# Altium schematic sheet SD-Card.SchDoc
size A4
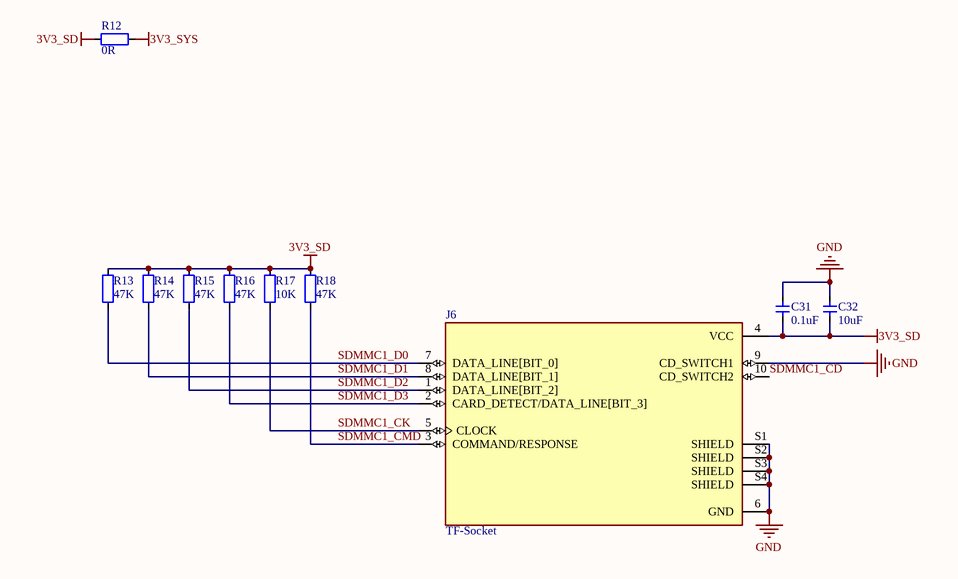
[diagram p0: SD-Card.SchDoc]

## Parts
C31  0.1uF  [CAP_0402]
C32  10uF  [CAP_0402]
J6  TF-Socket  [TF-Card-Amphenol with TF]
R12  0R  [RES_0402]
R13  47K  [RES_0402]
R14  47K  [RES_0402]
R15  47K  [RES_0402]
R16  47K  [RES_0402]
R17  10K  [RES_0402]
R18  47K  [RES_0402]

## Nets
3V3_SD: C31.2 C32.2 J6.4(VCC) R12.2 R13.1 R14.1 R15.1 R16.1 R17.1 R18.1
3V3_SYS: R12.1
GND: C31.1 C32.1 J6.6(GND) J6.9(CD_SWITCH1) J6.S1(SHIELD) J6.S2(SHIELD) J6.S3(SHIELD) J6.S4(SHIELD)
SDMMC1_CD: J6.10(CD_SWITCH2)
SDMMC1_CK: J6.5(CLOCK) R17.2
SDMMC1_CMD: J6.3(COMMAND/RESPONSE) R18.2
SDMMC1_D0: J6.7(DATA_LINE[BIT_0]) R13.2
SDMMC1_D1: J6.8(DATA_LINE[BIT_1]) R14.2
SDMMC1_D2: J6.1(DATA_LINE[BIT_2]) R15.2
SDMMC1_D3: J6.2(CARD_DETECT/DATA_LINE[BIT_3]) R16.2

## Library data of the parts
C31 C32 = 电容-0402: Capacitor; Value: 0.1u
J6 = TF-Socket: 10 _8 + 2_ Position Card Connector Secure Digital - microSDâ„¢ Surface Mount, Right Angle Gold; MP: 1140084168; MF: Amphenol Commercial Products; SnapEDA_Link: https://www.snapeda.com/parts/1140084168/Amphenol/view-part/4544529/?ref=snap; Availability: Unavailable; Price: None; Value: *; Package: None
R12-R18 = 电阻-0402: Resistor; Value: 22R